# EAGLE schematic board (EAGLE 5.11)
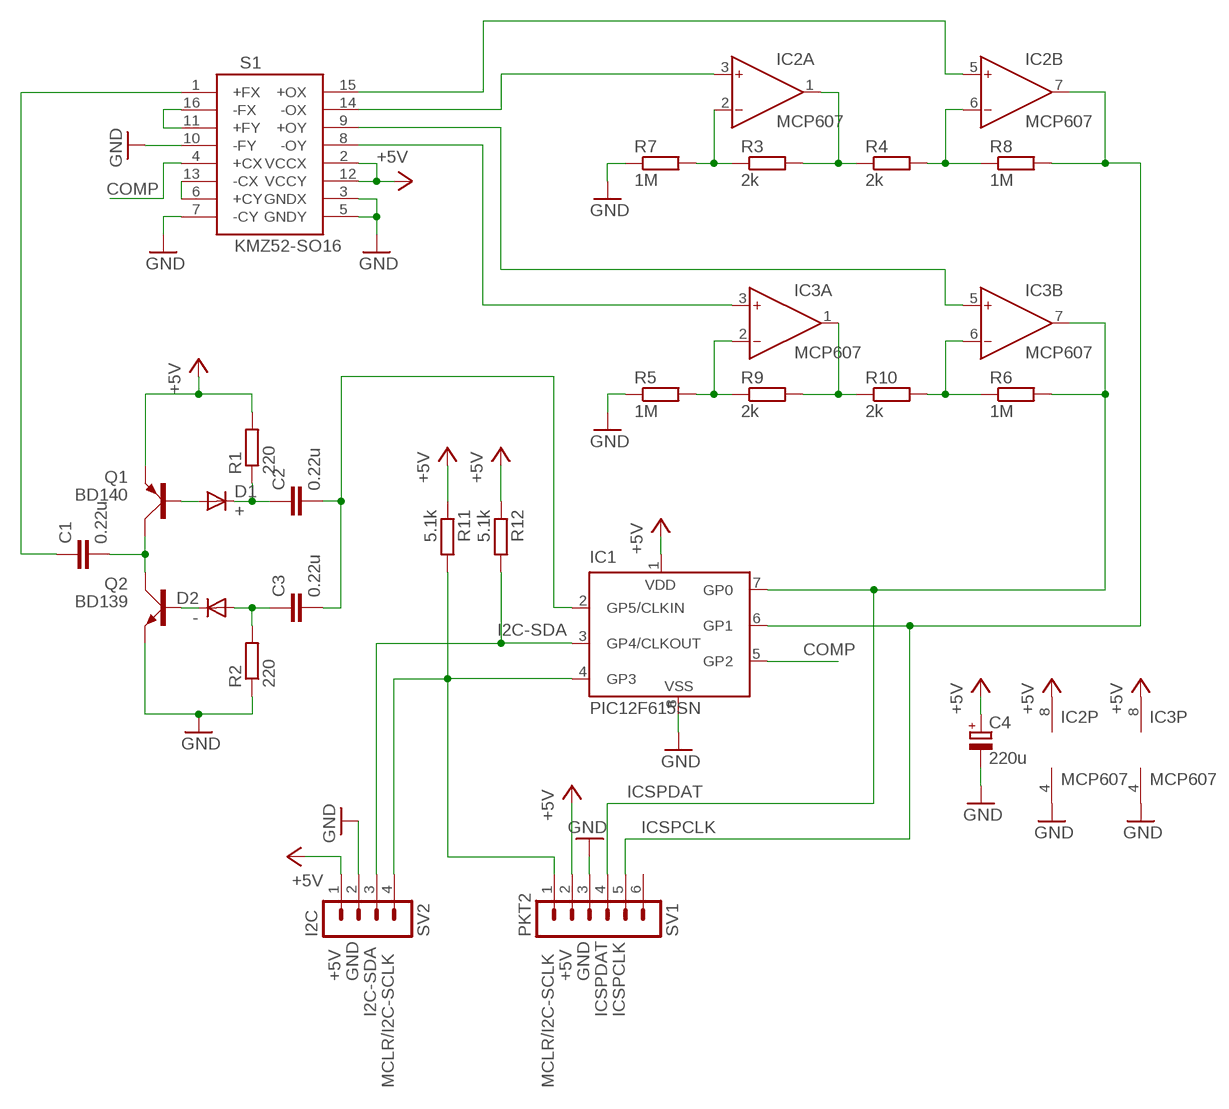
[diagram p0: schematic, sheet 1]

## Parts
C1  0.22u  C-EU025-024X044  [C025-024X044]
C2  0.22u  C-EU025-024X044  [C025-024X044]
C3  0.22u  C-EU025-024X044  [C025-024X044]
C4  220u  CPOL-EUE2,5-6E  [E2,5-6E]
D1  +  1N4148DO35-7  [DO35-7]
D2  -  1N4148DO35-7  [DO35-7]
IC1  PIC12F615SN  PIC12F629SN  [SO-08]
IC2  MCP607  AD712R  [SO8]
IC3  MCP607  AD712R  [SO8]
Q1  BD140  [TO126AV]
Q2  BD139  [TO126AV]
R1  220  R-EU_0204/5  [0204/5]
R2  220  R-EU_0204/5  [0204/5]
R3  2k  R-EU_0204/5  [0204/5]
R4  2k  R-EU_0204/5  [0204/5]
R5  1M  R-EU_0204/5  [0204/5]
R6  1M  R-EU_0204/5  [0204/5]
R7  1M  R-EU_M0805  [M0805]
R8  1M  R-EU_M0805  [M0805]
R9  2k  R-EU_M0805  [M0805]
R10  2k  R-EU_M0805  [M0805]
R11  5.1k  R-EU_0204/5  [0204/5]
R12  5.1k  R-EU_0204/5  [0204/5]
S1  KMZ52-SO16  [SO16]
SV1  PKT2  MA06-1  [MA06-1]
SV2  I2C  MA04-1  [MA04-1]

## Nets
+5V: C4.+ IC1.1(VDD) IC2.8(P:V+) IC3.8(P:V+) Q1.E R1.2 R11.1 R12.1 S1.2(VCCX) S1.12(VCCY) SV1.2 SV2.1
COMP: IC1.5(GP2) S1.4(+CX)
FLIP: C1.1 S1.1(+FX)
FLIP_IN: C2.2 C3.2 IC1.2(GP5/CLKIN)
GND: C4.- IC1.8(VSS) IC2.4(P:V-) IC3.4(P:V-) Q2.E R2.1 R5.1 R7.1 S1.3(GNDX) S1.5(GNDY) S1.7(-CY) S1.10(-FY) SV1.3 SV2.2
I2C-SDA: IC1.3(GP4/CLKOUT) R12.2 SV2.3
ICSPCLK: IC1.6(GP1) IC2.7(B:OUT) R8.2 SV1.5
ICSPDAT: IC1.7(GP0) IC3.7(B:OUT) R6.2 SV1.4
MCLR/I2C-SCLK: IC1.4(GP3) R11.2 SV1.1 SV2.4
N$1: C1.2 Q1.C Q2.C
N$2: D1.A Q1.B
N$3: D2.C Q2.B
N$4: C2.1 D1.C R1.1
N$5: C3.1 D2.A R2.2
N$6: S1.11(+FY) S1.16(-FX)
N$7: S1.6(+CY) S1.13(-CX)
N$8: IC2.2(A:IN-) R3.1 R7.2
N$9: IC2.1(A:OUT) R3.2 R4.1
N$10: IC2.6(B:IN-) R4.2 R8.1
N$12: IC2.3(A:IN+) S1.14(-OX)
N$13: IC2.5(B:IN+) S1.15(+OX)
N$14: IC3.2(A:IN-) R5.2 R9.1
N$15: IC3.1(A:OUT) R9.2 R10.1
N$16: IC3.6(B:IN-) R6.1 R10.2
N$18: IC3.3(A:IN+) S1.8(-OY)
N$19: IC3.5(B:IN+) S1.9(+OY)
Unconnected: SV1.6

## Library data of the parts
C1-C3 = rcl:C-EU: CAPACITOR, European symbol
C4 = rcl:CPOL-EU: POLARIZED CAPACITOR, European symbol
D1 D2 = diode:1N4148: DIODE high speed (Philips)
IC1 = microchip:PIC12F6*: Data Sheet 8-Pin FLASH-Based 8-Bit CMOS Microcontrollers Source: http://www.microchip.com .. 41190c.pdf; MF: MICROCHIP; MPN: PIC12F629-I/SN; OC_FARNELL: 9759000; OC_NEWARK: 61K3433
IC2 IC3 = analog-devices:AD712: Dual Precision, Low Cost, High Speed BiFET Op Amp Source: http://www.analog.com/static/imported-files/data_sheets/AD712.pdf; MF: ALTERA CORPORATION; MPN: AD712KRZ; OC_FARNELL: 1263975; OC_NEWARK: 59K4556
Q1 = transistor-power:BD140: PNP TRANSISTOR
Q2 = transistor-power:BD139: NPN TRANSISTOR
R1-R12 = rcl:R-EU_: RESISTOR, European symbol
S1 = shmuma:KMZ52-SO16
SV1 = con-lstb:MA06-1: PIN HEADER; OC_FARNELL: unknown; OC_NEWARK: unknown
SV2 = con-lstb:MA04-1: PIN HEADER; OC_FARNELL: unknown; OC_NEWARK: unknown